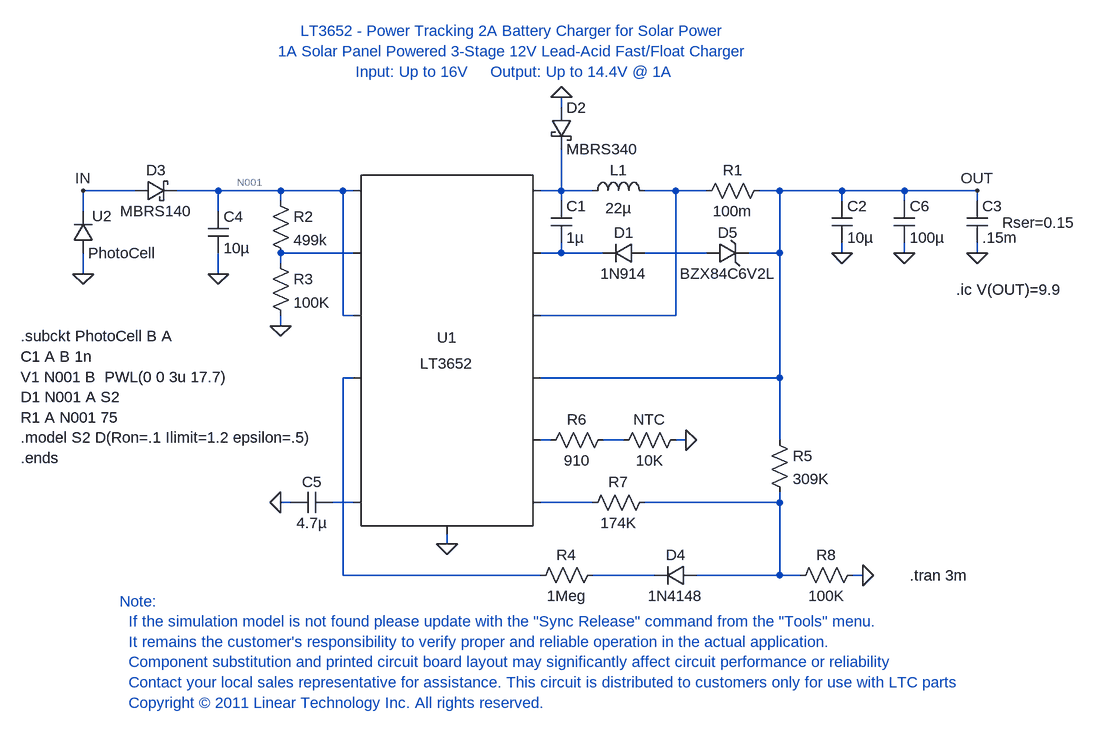
[diagram p0: schematic LT3652_TA04.asc]
LT3652_TA04.asc, the LTspice schematic file:
Version 4
SHEET 1 1484 932
WIRE 400 -192 400 -208
WIRE -256 -64 -336 -64
WIRE -128 -64 -192 -64
WIRE -32 -64 -128 -64
WIRE 64 -64 -32 -64
WIRE 80 -64 64 -64
WIRE 400 -64 400 -128
WIRE 400 -64 368 -64
WIRE 448 -64 400 -64
WIRE 576 -64 528 -64
WIRE 624 -64 576 -64
WIRE 736 -64 704 -64
WIRE 832 -64 736 -64
WIRE 928 -64 832 -64
WIRE 1040 -64 928 -64
WIRE -32 -48 -32 -64
WIRE 400 -48 400 -64
WIRE 832 -48 832 -64
WIRE 928 -48 928 -64
WIRE 1040 -48 1040 -64
WIRE -336 -32 -336 -64
WIRE -128 -32 -128 -64
WIRE 80 32 -32 32
WIRE 400 32 400 16
WIRE 400 32 368 32
WIRE 464 32 400 32
WIRE 624 32 528 32
WIRE 736 32 736 -64
WIRE 736 32 688 32
WIRE 832 32 832 16
WIRE 928 32 928 16
WIRE 1040 32 1040 16
WIRE -32 48 -32 32
WIRE -336 64 -336 32
WIRE -128 64 -128 32
WIRE 64 128 64 -64
WIRE 80 128 64 128
WIRE 576 128 576 -64
WIRE 576 128 368 128
WIRE -32 144 -32 128
WIRE 80 224 64 224
WIRE 736 224 736 32
WIRE 736 224 368 224
WIRE 384 320 368 320
WIRE 496 320 464 320
WIRE 592 320 576 320
WIRE 736 320 736 224
WIRE -16 416 -32 416
WIRE 80 416 48 416
WIRE 448 416 368 416
WIRE 736 416 736 400
WIRE 736 416 528 416
WIRE 224 480 224 464
WIRE 64 528 64 224
WIRE 368 528 64 528
WIRE 544 528 448 528
WIRE 736 528 736 416
WIRE 736 528 608 528
WIRE 768 528 736 528
WIRE 864 528 848 528
FLAG 224 480 0
FLAG 400 -208 0
FLAG -128 64 0
FLAG -32 416 0
FLAG 864 528 0
FLAG 592 320 0
FLAG 832 32 0
FLAG 1040 32 0
FLAG -336 -64 IN
FLAG -336 64 0
FLAG 1040 -64 OUT
FLAG -32 144 0
FLAG 928 32 0
SYMBOL PowerProducts\\LT3652 224 176 R0
SYMATTR InstName U1
SYMBOL res 608 -48 R270
WINDOW 0 32 56 VTop 2
WINDOW 3 0 56 VBottom 2
SYMATTR InstName R1
SYMATTR Value 100m
SYMBOL cap 384 -48 R0
SYMATTR InstName C1
SYMATTR Value 1µ
SYMBOL diode 528 16 R90
WINDOW 0 0 32 VBottom 2
WINDOW 3 32 32 VTop 2
SYMATTR InstName D1
SYMATTR Value 1N914
SYMBOL schottky 384 -192 R0
SYMATTR Value MBRS340
SYMATTR InstName D2
SYMATTR Description Diode
SYMATTR Type diode
SYMBOL schottky -256 -48 R270
WINDOW 0 32 32 VTop 2
WINDOW 3 0 32 VBottom 2
SYMATTR InstName D3
SYMATTR Value MBRS140
SYMATTR Description Diode
SYMATTR Type diode
SYMBOL res -48 -64 R0
SYMATTR InstName R2
SYMATTR Value 499k
SYMBOL res -48 32 R0
SYMATTR InstName R3
SYMATTR Value 100K
SYMBOL res 464 512 R90
WINDOW 0 0 56 VBottom 2
WINDOW 3 32 56 VTop 2
SYMATTR InstName R4
SYMATTR Value 1Meg
SYMBOL diode 608 512 R90
WINDOW 0 0 32 VBottom 2
WINDOW 3 32 32 VTop 2
SYMATTR InstName D4
SYMATTR Value 1N4148
SYMBOL res 720 304 R0
SYMATTR InstName R5
SYMATTR Value 309K
SYMBOL res 480 304 R90
WINDOW 0 0 56 VBottom 2
WINDOW 3 32 56 VTop 2
SYMATTR InstName R6
SYMATTR Value 910
SYMBOL res 544 400 R90
WINDOW 0 0 56 VBottom 2
WINDOW 3 32 56 VTop 2
SYMATTR InstName R7
SYMATTR Value 174K
SYMBOL res 752 544 R270
WINDOW 0 32 56 VTop 2
WINDOW 3 0 56 VBottom 2
SYMATTR InstName R8
SYMATTR Value 100K
SYMBOL res 480 336 R270
WINDOW 0 32 56 VTop 2
WINDOW 3 0 56 VBottom 2
SYMATTR InstName NTC
SYMATTR Value 10K
SYMBOL cap 816 -48 R0
SYMATTR InstName C2
SYMATTR Value 10µ
SYMATTR SpiceLine Rser=0.003
SYMBOL zener 624 48 R270
WINDOW 0 32 32 VTop 2
WINDOW 3 0 32 VBottom 2
SYMATTR InstName D5
SYMATTR Value BZX84C6V2L
SYMATTR Description Diode
SYMATTR Type diode
SYMBOL diode -352 32 M180
WINDOW 0 30 57 Left 2
WINDOW 3 24 0 Left 2
SYMATTR InstName U2
SYMATTR Value PhotoCell
SYMATTR Prefix X
SYMBOL cap -144 -32 R0
SYMATTR InstName C4
SYMATTR Value 10µ
SYMBOL cap 48 400 R90
WINDOW 0 0 32 VBottom 2
WINDOW 3 32 32 VTop 2
SYMATTR InstName C5
SYMATTR Value 4.7µ
SYMBOL ind 432 -48 R270
WINDOW 0 32 56 VTop 2
WINDOW 3 5 56 VBottom 2
SYMATTR InstName L1
SYMATTR Value 22µ
SYMATTR SpiceLine Ipk=1.7 Rser=0.11 Rpar=21068 Cpar=5.6p mfg="Wurth Elektronik" pn="7447779122 WE-PD M"
SYMBOL cap 1024 -48 R0
WINDOW 39 55 33 Left 2
SYMATTR SpiceLine Rser=0.15
SYMATTR InstName C3
SYMATTR Value .15m
SYMBOL cap 912 -48 R0
SYMATTR InstName C6
SYMATTR Value 100µ
SYMATTR SpiceLine Rser=0.003
TEXT 936 528 Left 2 !.tran 3m
TEXT -432 160 Left 2 !.subckt PhotoCell B A\nC1 A B 1n\nV1 N001 B  PWL(0 0 3u 17.7)\nD1 N001 A S2\nR1 A N001 75\n.model S2 D(Ron=.1 Ilimit=1.2 epsilon=.5)\n.ends
TEXT 328 -232 Bottom 2 ;LT3652 - Power Tracking 2A Battery Charger for Solar Power\n1A Solar Panel Powered 3-Stage 12V Lead-Acid Fast/Float Charger\nInput: Up to 16V     Output: Up to 14.4V @ 1A
TEXT -280 568 Left 2 ;Note:\n  If the simulation model is not found please update with the "Sync Release" command from the "Tools" menu.\n  It remains the customer's responsibility to verify proper and reliable operation in the actual application.\n  Component substitution and printed circuit board layout may significantly affect circuit performance or reliability\n  Contact your local sales representative for assistance. This circuit is distributed to customers only for use with LTC parts\n  Copyright © 2011 Linear Technology Inc. All rights reserved.
TEXT 1008 88 Left 2 !.ic V(OUT)=9.9

The netlist it stands for:
* LT3652_TA04.asc
XU1 N001 N004 N001 N007 NC_01 N010 N011 N008 OUT N003 N005 N002 0 LT3652
R1 N003 OUT 100m
C1 N002 N005 1µ
D1 N006 N005 1N914
D2 0 N002 MBRS340
D3 IN N001 MBRS140
R2 N001 N004 499k
R3 N004 0 100K
R4 N013 N007 1Meg
D4 N012 N013 1N4148
R5 OUT N012 309K
R6 N009 N008 910
R7 N012 N011 174K
R8 N012 0 100K
R§NTC N009 0 10K
C2 OUT 0 10µ Rser=0.003
D5 N006 OUT BZX84C6V2L
XU2 0 IN PhotoCell  ; pins + -
C4 N001 0 10µ
C5 N010 0 4.7µ
L1 N002 N003 22µ Ipk=1.7 Rser=0.11 Rpar=21068 Cpar=5.6p mfg="Wurth Elektronik" pn="7447779122 WE-PD M"
C3 OUT 0 .15m Rser=0.15
C6 OUT 0 100µ Rser=0.003
.model D D
.lib standard.dio
.tran 3m
.subckt PhotoCell B A
C1 A B 1n
V1 N001 B  PWL(0 0 3u 17.7)
D1 N001 A S2
R1 A N001 75
.model S2 D(Ron=.1 Ilimit=1.2 epsilon=.5)
.ends
* LT3652 - Power Tracking 2A Battery Charger for Solar Power
* 1A Solar Panel Powered 3-Stage 12V Lead-Acid Fast/Float Charger
* Input: Up to 16V     Output: Up to 14.4V @ 1A
* Note:
*   If the simulation model is not found please update with the "Sync Release" command from the "Tools" menu.
*   It remains the customer's responsibility to verify proper and reliable operation in the actual application.
*   Component substitution and printed circuit board layout may significantly affect circuit performance or reliability
*   Contact your local sales representative for assistance. This circuit is distributed to customers only for use with LTC parts
*   Copyright © 2011 Linear Technology Inc. All rights reserved.
.ic V(OUT)=9.9
.lib LT3652.sub
.backanno
.end